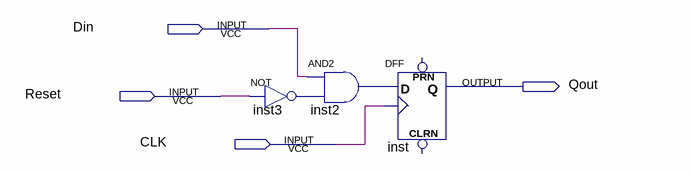
[diagram p0: schematic sheet]
// Quartus schematic ex1Synchronous.bdf as structural Verilog: 3 symbols, 4 pins
module ex1Synchronous (
  input  Din,
  input  Reset,
  input  CLK,
  output Qout
);

  wire inst2_out, inst3_out;

  and inst2 (inst2_out, Din, inst3_out);
  not inst3 (inst3_out, Reset);
  DFF inst (.CLK(CLK), .D(inst2_out), .Q(Qout));  // open: CLRN, PRN
endmodule
